# EAGLE schematic rel-alu (EAGLE 9.6.2)
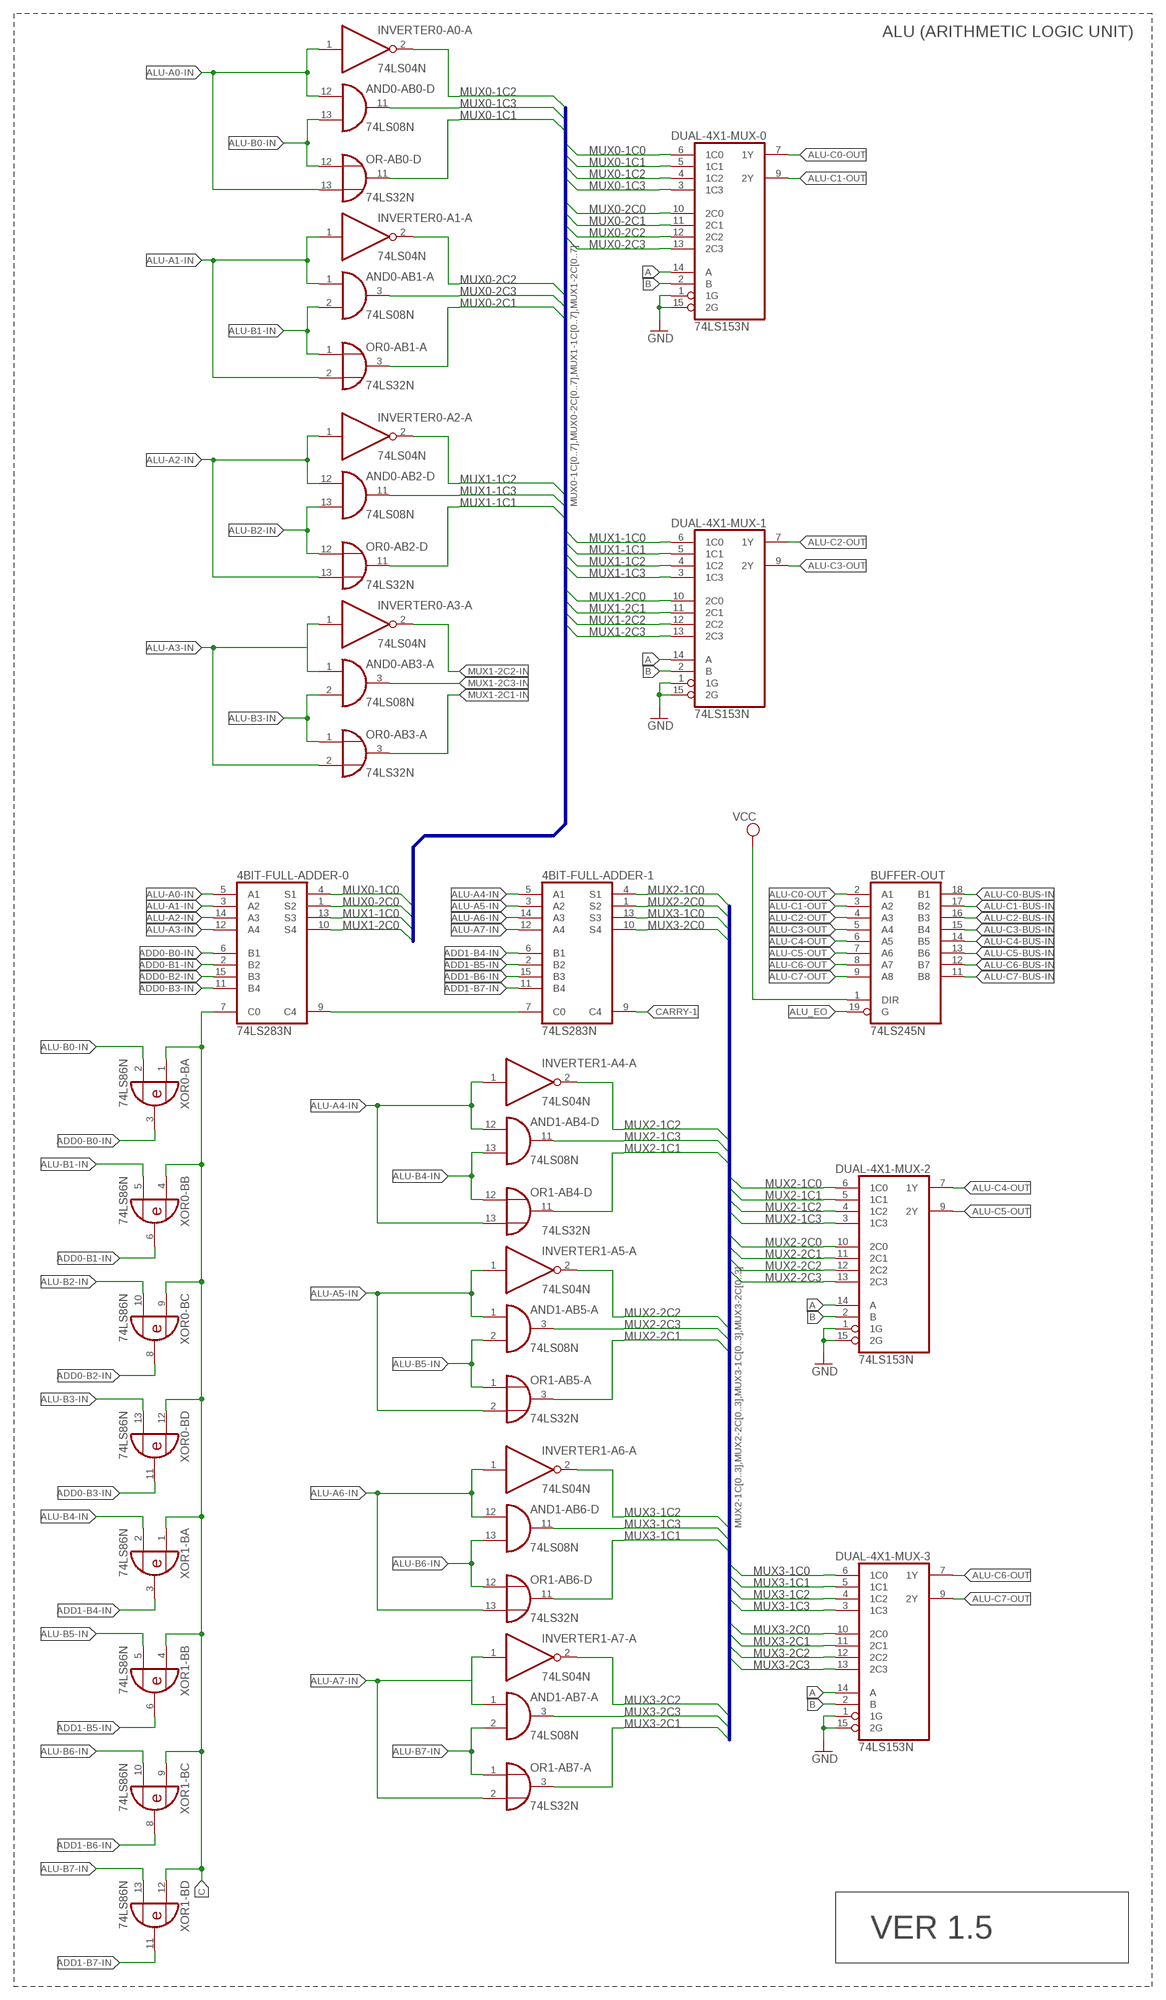
[diagram p0: schematic, sheet 1]

## Parts
4BIT-FULL-ADDER-0  74LS283N  [DIL16]
4BIT-FULL-ADDER-1  74LS283N  [DIL16]
AND0-AB0-  74LS08N  [DIL14]
AND0-AB1-  74LS08N  [DIL14]
AND0-AB2-  74LS08N  [DIL14]
AND0-AB3-  74LS08N  [DIL14]
AND1-AB4-  74LS08N  [DIL14]
AND1-AB5-  74LS08N  [DIL14]
AND1-AB6-  74LS08N  [DIL14]
AND1-AB7-  74LS08N  [DIL14]
BUFFER-OUT  74LS245N  [DIL20]
DUAL-4X1-MUX-0  74LS153N  [DIL16]
DUAL-4X1-MUX-1  74LS153N  [DIL16]
DUAL-4X1-MUX-2  74LS153N  [DIL16]
DUAL-4X1-MUX-3  74LS153N  [DIL16]
INVERTER0-A0-  74LS04N  [DIL14]
INVERTER0-A1-  74LS04N  [DIL14]
INVERTER0-A2-  74LS04N  [DIL14]
INVERTER0-A3-  74LS04N  [DIL14]
INVERTER1-A4-  74LS04N  [DIL14]
INVERTER1-A5-  74LS04N  [DIL14]
INVERTER1-A6-  74LS04N  [DIL14]
INVERTER1-A7-  74LS04N  [DIL14]
OR0-AB1-  74LS32N  [DIL14]
OR0-AB2-  74LS32N  [DIL14]
OR0-AB3-  74LS32N  [DIL14]
OR1-AB4-  74LS32N  [DIL14]
OR1-AB5-  74LS32N  [DIL14]
OR1-AB6-  74LS32N  [DIL14]
OR1-AB7-  74LS32N  [DIL14]
OR-AB0-  74LS32N  [DIL14]
XOR0-B  74LS86N  [DIL14]
XOR1-B  74LS86N  [DIL14]

## Nets
A: DUAL-4X1-MUX-0.14(A) DUAL-4X1-MUX-1.14(A) DUAL-4X1-MUX-2.14(A) DUAL-4X1-MUX-3.14(A)
ADD0-B0-IN: 4BIT-FULL-ADDER-0.6(B1) XOR0-B.3(A:O)
ADD0-B1-IN: 4BIT-FULL-ADDER-0.2(B2) XOR0-B.6(B:O)
ADD0-B2-IN: 4BIT-FULL-ADDER-0.15(B3) XOR0-B.8(C:O)
ADD0-B3-IN: 4BIT-FULL-ADDER-0.11(B4) XOR0-B.11(D:O)
ADD1-B4-IN: 4BIT-FULL-ADDER-1.6(B1) XOR1-B.3(A:O)
ADD1-B5-IN: 4BIT-FULL-ADDER-1.2(B2) XOR1-B.6(B:O)
ADD1-B6-IN: 4BIT-FULL-ADDER-1.15(B3) XOR1-B.8(C:O)
ADD1-B7-IN: 4BIT-FULL-ADDER-1.11(B4) XOR1-B.11(D:O)
ALU-A0-IN: 4BIT-FULL-ADDER-0.5(A1) AND0-AB0-.12(D:I0) INVERTER0-A0-.1(A:I) OR-AB0-.13(D:I1)
ALU-A1-IN: 4BIT-FULL-ADDER-0.3(A2) AND0-AB1-.1(A:I0) INVERTER0-A1-.1(A:I) OR0-AB1-.2(A:I1)
ALU-A2-IN: 4BIT-FULL-ADDER-0.14(A3) AND0-AB2-.12(D:I0) INVERTER0-A2-.1(A:I) OR0-AB2-.13(D:I1)
ALU-A3-IN: 4BIT-FULL-ADDER-0.12(A4) AND0-AB3-.1(A:I0) INVERTER0-A3-.1(A:I) OR0-AB3-.2(A:I1)
ALU-A4-IN: 4BIT-FULL-ADDER-1.5(A1) AND1-AB4-.12(D:I0) INVERTER1-A4-.1(A:I) OR1-AB4-.13(D:I1)
ALU-A5-IN: 4BIT-FULL-ADDER-1.3(A2) AND1-AB5-.1(A:I0) INVERTER1-A5-.1(A:I) OR1-AB5-.2(A:I1)
ALU-A6-IN: 4BIT-FULL-ADDER-1.14(A3) AND1-AB6-.12(D:I0) INVERTER1-A6-.1(A:I) OR1-AB6-.13(D:I1)
ALU-A7-IN: 4BIT-FULL-ADDER-1.12(A4) AND1-AB7-.1(A:I0) INVERTER1-A7-.1(A:I) OR1-AB7-.2(A:I1)
ALU-B0-IN: AND0-AB0-.13(D:I1) OR-AB0-.12(D:I0) XOR0-B.2(A:I1)
ALU-B1-IN: AND0-AB1-.2(A:I1) OR0-AB1-.1(A:I0) XOR0-B.5(B:I1)
ALU-B2-IN: AND0-AB2-.13(D:I1) OR0-AB2-.12(D:I0) XOR0-B.10(C:I1)
ALU-B3-IN: AND0-AB3-.2(A:I1) OR0-AB3-.1(A:I0) XOR0-B.13(D:I1)
ALU-B4-IN: AND1-AB4-.13(D:I1) OR1-AB4-.12(D:I0) XOR1-B.2(A:I1)
ALU-B5-IN: AND1-AB5-.2(A:I1) OR1-AB5-.1(A:I0) XOR1-B.5(B:I1)
ALU-B6-IN: AND1-AB6-.13(D:I1) OR1-AB6-.12(D:I0) XOR1-B.10(C:I1)
ALU-B7-IN: AND1-AB7-.2(A:I1) OR1-AB7-.1(A:I0) XOR1-B.13(D:I1)
ALU-C0-BUS-IN: BUFFER-OUT.18(B1)
ALU-C0-OUT: BUFFER-OUT.2(A1) DUAL-4X1-MUX-0.7(1Y)
ALU-C1-BUS-IN: BUFFER-OUT.17(B2)
ALU-C1-OUT: BUFFER-OUT.3(A2) DUAL-4X1-MUX-0.9(2Y)
ALU-C2-BUS-IN: BUFFER-OUT.16(B3)
ALU-C2-OUT: BUFFER-OUT.4(A3) DUAL-4X1-MUX-1.7(1Y)
ALU-C3-BUS-IN: BUFFER-OUT.15(B4)
ALU-C3-OUT: BUFFER-OUT.5(A4) DUAL-4X1-MUX-1.9(2Y)
ALU-C4-BUS-IN: BUFFER-OUT.14(B5)
ALU-C4-OUT: BUFFER-OUT.6(A5) DUAL-4X1-MUX-2.7(1Y)
ALU-C5-BUS-IN: BUFFER-OUT.13(B6)
ALU-C5-OUT: BUFFER-OUT.7(A6) DUAL-4X1-MUX-2.9(2Y)
ALU-C6-BUS-IN: BUFFER-OUT.12(B7)
ALU-C6-OUT: BUFFER-OUT.8(A7) DUAL-4X1-MUX-3.7(1Y)
ALU-C7-BUS-IN: BUFFER-OUT.11(B8)
ALU-C7-OUT: BUFFER-OUT.9(A8) DUAL-4X1-MUX-3.9(2Y)
ALU_EO: BUFFER-OUT.19(G)
B: DUAL-4X1-MUX-0.2(B) DUAL-4X1-MUX-1.2(B) DUAL-4X1-MUX-2.2(B) DUAL-4X1-MUX-3.2(B)
C: 4BIT-FULL-ADDER-0.7(C0) XOR0-B.1(A:I0) XOR0-B.4(B:I0) XOR0-B.9(C:I0) XOR0-B.12(D:I0) XOR1-B.1(A:I0) XOR1-B.4(B:I0) XOR1-B.9(C:I0) XOR1-B.12(D:I0)
CARRY-1: 4BIT-FULL-ADDER-1.9(C4)
GND: DUAL-4X1-MUX-0.1(1G) DUAL-4X1-MUX-0.15(2G) DUAL-4X1-MUX-1.1(1G) DUAL-4X1-MUX-1.15(2G) DUAL-4X1-MUX-2.1(1G) DUAL-4X1-MUX-2.15(2G) DUAL-4X1-MUX-3.1(1G) DUAL-4X1-MUX-3.15(2G)
MUX0-1C0: 4BIT-FULL-ADDER-0.4(S1) DUAL-4X1-MUX-0.6(1C0)
MUX0-1C1: DUAL-4X1-MUX-0.5(1C1) OR-AB0-.11(D:O)
MUX0-1C2: DUAL-4X1-MUX-0.4(1C2) INVERTER0-A0-.2(A:O)
MUX0-1C3: AND0-AB0-.11(D:O) DUAL-4X1-MUX-0.3(1C3)
MUX0-2C0: 4BIT-FULL-ADDER-0.1(S2) DUAL-4X1-MUX-0.10(2C0)
MUX0-2C1: DUAL-4X1-MUX-0.11(2C1) OR0-AB1-.3(A:O)
MUX0-2C2: DUAL-4X1-MUX-0.12(2C2) INVERTER0-A1-.2(A:O)
MUX0-2C3: AND0-AB1-.3(A:O) DUAL-4X1-MUX-0.13(2C3)
MUX1-1C0: 4BIT-FULL-ADDER-0.13(S3) DUAL-4X1-MUX-1.6(1C0)
MUX1-1C1: DUAL-4X1-MUX-1.5(1C1) OR0-AB2-.11(D:O)
MUX1-1C2: DUAL-4X1-MUX-1.4(1C2) INVERTER0-A2-.2(A:O)
MUX1-1C3: AND0-AB2-.11(D:O) DUAL-4X1-MUX-1.3(1C3)
MUX1-2C0: 4BIT-FULL-ADDER-0.10(S4) DUAL-4X1-MUX-1.10(2C0)
MUX1-2C1: DUAL-4X1-MUX-1.11(2C1)
MUX1-2C1-IN: OR0-AB3-.3(A:O)
MUX1-2C2: DUAL-4X1-MUX-1.12(2C2)
MUX1-2C2-IN: INVERTER0-A3-.2(A:O)
MUX1-2C3: DUAL-4X1-MUX-1.13(2C3)
MUX1-2C3-IN: AND0-AB3-.3(A:O)
MUX2-1C0: 4BIT-FULL-ADDER-1.4(S1) DUAL-4X1-MUX-2.6(1C0)
MUX2-1C1: DUAL-4X1-MUX-2.5(1C1) OR1-AB4-.11(D:O)
MUX2-1C2: DUAL-4X1-MUX-2.4(1C2) INVERTER1-A4-.2(A:O)
MUX2-1C3: AND1-AB4-.11(D:O) DUAL-4X1-MUX-2.3(1C3)
MUX2-2C0: 4BIT-FULL-ADDER-1.1(S2) DUAL-4X1-MUX-2.10(2C0)
MUX2-2C1: DUAL-4X1-MUX-2.11(2C1) OR1-AB5-.3(A:O)
MUX2-2C2: DUAL-4X1-MUX-2.12(2C2) INVERTER1-A5-.2(A:O)
MUX2-2C3: AND1-AB5-.3(A:O) DUAL-4X1-MUX-2.13(2C3)
MUX3-1C0: 4BIT-FULL-ADDER-1.13(S3) DUAL-4X1-MUX-3.6(1C0)
MUX3-1C1: DUAL-4X1-MUX-3.5(1C1) OR1-AB6-.11(D:O)
MUX3-1C2: DUAL-4X1-MUX-3.4(1C2) INVERTER1-A6-.2(A:O)
MUX3-1C3: AND1-AB6-.11(D:O) DUAL-4X1-MUX-3.3(1C3)
MUX3-2C0: 4BIT-FULL-ADDER-1.10(S4) DUAL-4X1-MUX-3.10(2C0)
MUX3-2C1: DUAL-4X1-MUX-3.11(2C1) OR1-AB7-.3(A:O)
MUX3-2C2: DUAL-4X1-MUX-3.12(2C2) INVERTER1-A7-.2(A:O)
MUX3-2C3: AND1-AB7-.3(A:O) DUAL-4X1-MUX-3.13(2C3)
N$1: 4BIT-FULL-ADDER-0.9(C4) 4BIT-FULL-ADDER-1.7(C0)
VCC: BUFFER-OUT.1(DIR)
Unconnected: AND0-AB0-.1(A:I0) AND0-AB0-.2(A:I1) AND0-AB0-.3(A:O) AND0-AB0-.4(B:I0) AND0-AB0-.5(B:I1) AND0-AB0-.6(B:O) AND0-AB0-.8(C:O) AND0-AB0-.9(C:I0) AND0-AB0-.10(C:I1) AND0-AB1-.4(B:I0) AND0-AB1-.5(B:I1) AND0-AB1-.6(B:O) AND0-AB1-.8(C:O) AND0-AB1-.9(C:I0) AND0-AB1-.10(C:I1) AND0-AB1-.11(D:O) AND0-AB1-.12(D:I0) AND0-AB1-.13(D:I1) AND0-AB2-.1(A:I0) AND0-AB2-.2(A:I1) AND0-AB2-.3(A:O) AND0-AB2-.4(B:I0) AND0-AB2-.5(B:I1) AND0-AB2-.6(B:O) AND0-AB2-.8(C:O) AND0-AB2-.9(C:I0) AND0-AB2-.10(C:I1) AND0-AB3-.4(B:I0) AND0-AB3-.5(B:I1) AND0-AB3-.6(B:O) AND0-AB3-.8(C:O) AND0-AB3-.9(C:I0) AND0-AB3-.10(C:I1) AND0-AB3-.11(D:O) AND0-AB3-.12(D:I0) AND0-AB3-.13(D:I1) AND1-AB4-.1(A:I0) AND1-AB4-.2(A:I1) AND1-AB4-.3(A:O) AND1-AB4-.4(B:I0) AND1-AB4-.5(B:I1) AND1-AB4-.6(B:O) AND1-AB4-.8(C:O) AND1-AB4-.9(C:I0) AND1-AB4-.10(C:I1) AND1-AB5-.4(B:I0) AND1-AB5-.5(B:I1) AND1-AB5-.6(B:O) AND1-AB5-.8(C:O) AND1-AB5-.9(C:I0) AND1-AB5-.10(C:I1) AND1-AB5-.11(D:O) AND1-AB5-.12(D:I0) AND1-AB5-.13(D:I1) AND1-AB6-.1(A:I0) AND1-AB6-.2(A:I1) AND1-AB6-.3(A:O) AND1-AB6-.4(B:I0) AND1-AB6-.5(B:I1) AND1-AB6-.6(B:O) AND1-AB6-.8(C:O) AND1-AB6-.9(C:I0) AND1-AB6-.10(C:I1) AND1-AB7-.4(B:I0) AND1-AB7-.5(B:I1) AND1-AB7-.6(B:O) AND1-AB7-.8(C:O) AND1-AB7-.9(C:I0) AND1-AB7-.10(C:I1) AND1-AB7-.11(D:O) AND1-AB7-.12(D:I0) AND1-AB7-.13(D:I1) INVERTER0-A0-.3(B:I) INVERTER0-A0-.4(B:O) INVERTER0-A0-.5(C:I) INVERTER0-A0-.6(C:O) INVERTER0-A0-.8(D:O) INVERTER0-A0-.9(D:I) INVERTER0-A0-.10(E:O) INVERTER0-A0-.11(E:I) INVERTER0-A0-.12(F:O) INVERTER0-A0-.13(F:I) INVERTER0-A1-.3(B:I) INVERTER0-A1-.4(B:O) INVERTER0-A1-.5(C:I) INVERTER0-A1-.6(C:O) INVERTER0-A1-.8(D:O) INVERTER0-A1-.9(D:I) INVERTER0-A1-.10(E:O) INVERTER0-A1-.11(E:I) INVERTER0-A1-.12(F:O) INVERTER0-A1-.13(F:I) INVERTER0-A2-.3(B:I) INVERTER0-A2-.4(B:O) INVERTER0-A2-.5(C:I) INVERTER0-A2-.6(C:O) INVERTER0-A2-.8(D:O) INVERTER0-A2-.9(D:I) INVERTER0-A2-.10(E:O) INVERTER0-A2-.11(E:I) INVERTER0-A2-.12(F:O) INVERTER0-A2-.13(F:I) INVERTER0-A3-.3(B:I) INVERTER0-A3-.4(B:O) INVERTER0-A3-.5(C:I) INVERTER0-A3-.6(C:O) INVERTER0-A3-.8(D:O) INVERTER0-A3-.9(D:I) INVERTER0-A3-.10(E:O) INVERTER0-A3-.11(E:I) INVERTER0-A3-.12(F:O) INVERTER0-A3-.13(F:I) INVERTER1-A4-.3(B:I) INVERTER1-A4-.4(B:O) INVERTER1-A4-.5(C:I) INVERTER1-A4-.6(C:O) INVERTER1-A4-.8(D:O) INVERTER1-A4-.9(D:I) INVERTER1-A4-.10(E:O) INVERTER1-A4-.11(E:I) INVERTER1-A4-.12(F:O) INVERTER1-A4-.13(F:I) INVERTER1-A5-.3(B:I) INVERTER1-A5-.4(B:O) INVERTER1-A5-.5(C:I) INVERTER1-A5-.6(C:O) INVERTER1-A5-.8(D:O) INVERTER1-A5-.9(D:I) INVERTER1-A5-.10(E:O) INVERTER1-A5-.11(E:I) INVERTER1-A5-.12(F:O) INVERTER1-A5-.13(F:I) INVERTER1-A6-.3(B:I) INVERTER1-A6-.4(B:O) INVERTER1-A6-.5(C:I) INVERTER1-A6-.6(C:O) INVERTER1-A6-.8(D:O) INVERTER1-A6-.9(D:I) INVERTER1-A6-.10(E:O) INVERTER1-A6-.11(E:I) INVERTER1-A6-.12(F:O) INVERTER1-A6-.13(F:I) INVERTER1-A7-.3(B:I) INVERTER1-A7-.4(B:O) INVERTER1-A7-.5(C:I) INVERTER1-A7-.6(C:O) INVERTER1-A7-.8(D:O) INVERTER1-A7-.9(D:I) INVERTER1-A7-.10(E:O) INVERTER1-A7-.11(E:I) INVERTER1-A7-.12(F:O) INVERTER1-A7-.13(F:I) OR0-AB1-.4(B:I0) OR0-AB1-.5(B:I1) OR0-AB1-.6(B:O) OR0-AB1-.8(C:O) OR0-AB1-.9(C:I0) OR0-AB1-.10(C:I1) OR0-AB1-.11(D:O) OR0-AB1-.12(D:I0) OR0-AB1-.13(D:I1) OR0-AB2-.1(A:I0) OR0-AB2-.2(A:I1) OR0-AB2-.3(A:O) OR0-AB2-.4(B:I0) OR0-AB2-.5(B:I1) OR0-AB2-.6(B:O) OR0-AB2-.8(C:O) OR0-AB2-.9(C:I0) OR0-AB2-.10(C:I1) OR0-AB3-.4(B:I0) OR0-AB3-.5(B:I1) OR0-AB3-.6(B:O) OR0-AB3-.8(C:O) OR0-AB3-.9(C:I0) OR0-AB3-.10(C:I1) OR0-AB3-.11(D:O) OR0-AB3-.12(D:I0) OR0-AB3-.13(D:I1) OR1-AB4-.1(A:I0) OR1-AB4-.2(A:I1) OR1-AB4-.3(A:O) OR1-AB4-.4(B:I0) OR1-AB4-.5(B:I1) OR1-AB4-.6(B:O) OR1-AB4-.8(C:O) OR1-AB4-.9(C:I0) OR1-AB4-.10(C:I1) OR1-AB5-.4(B:I0) OR1-AB5-.5(B:I1) OR1-AB5-.6(B:O) OR1-AB5-.8(C:O) OR1-AB5-.9(C:I0) OR1-AB5-.10(C:I1) OR1-AB5-.11(D:O) OR1-AB5-.12(D:I0) OR1-AB5-.13(D:I1) OR1-AB6-.1(A:I0) OR1-AB6-.2(A:I1) OR1-AB6-.3(A:O) OR1-AB6-.4(B:I0) OR1-AB6-.5(B:I1) OR1-AB6-.6(B:O) OR1-AB6-.8(C:O) OR1-AB6-.9(C:I0) OR1-AB6-.10(C:I1) OR1-AB7-.4(B:I0) OR1-AB7-.5(B:I1) OR1-AB7-.6(B:O) OR1-AB7-.8(C:O) OR1-AB7-.9(C:I0) OR1-AB7-.10(C:I1) OR1-AB7-.11(D:O) OR1-AB7-.12(D:I0) OR1-AB7-.13(D:I1) OR-AB0-.1(A:I0) OR-AB0-.2(A:I1) OR-AB0-.3(A:O) OR-AB0-.4(B:I0) OR-AB0-.5(B:I1) OR-AB0-.6(B:O) OR-AB0-.8(C:O) OR-AB0-.9(C:I0) OR-AB0-.10(C:I1)

## Buses
MUX0-1C[0..7],MUX0-2C[0..7],MUX1-1C[0..7],MUX1-2C[0..7]
MUX2-1C[0..3],MUX2-2C[0..3],MUX3-1C[0..3],MUX3-2C[0..3]

## Notes on the sheet
- ALU (ARITHMETIC LOGIC UNIT)
- VER 1.5

## Power pins joined to a net without a drawn wire
GND: 4BIT-FULL-ADDER-0.8(GND) 4BIT-FULL-ADDER-1.8(GND) AND0-AB0-.7(P:GND) AND0-AB1-.7(P:GND) AND0-AB2-.7(P:GND) AND0-AB3-.7(P:GND) AND1-AB4-.7(P:GND) AND1-AB5-.7(P:GND) AND1-AB6-.7(P:GND) AND1-AB7-.7(P:GND) BUFFER-OUT.10(GND) DUAL-4X1-MUX-0.8(GND) DUAL-4X1-MUX-1.8(GND) DUAL-4X1-MUX-2.8(GND) DUAL-4X1-MUX-3.8(GND) INVERTER0-A0-.7(P:GND) INVERTER0-A1-.7(P:GND) INVERTER0-A2-.7(P:GND) INVERTER0-A3-.7(P:GND) INVERTER1-A4-.7(P:GND) INVERTER1-A5-.7(P:GND) INVERTER1-A6-.7(P:GND) INVERTER1-A7-.7(P:GND) OR0-AB1-.7(P:GND) OR0-AB2-.7(P:GND) OR0-AB3-.7(P:GND) OR1-AB4-.7(P:GND) OR1-AB5-.7(P:GND) OR1-AB6-.7(P:GND) OR1-AB7-.7(P:GND) OR-AB0-.7(P:GND) XOR0-B.7(P:GND) XOR1-B.7(P:GND)
VCC: 4BIT-FULL-ADDER-0.16(VCC) 4BIT-FULL-ADDER-1.16(VCC) AND0-AB0-.14(P:VCC) AND0-AB1-.14(P:VCC) AND0-AB2-.14(P:VCC) AND0-AB3-.14(P:VCC) AND1-AB4-.14(P:VCC) AND1-AB5-.14(P:VCC) AND1-AB6-.14(P:VCC) AND1-AB7-.14(P:VCC) BUFFER-OUT.20(VCC) DUAL-4X1-MUX-0.16(VCC) DUAL-4X1-MUX-1.16(VCC) DUAL-4X1-MUX-2.16(VCC) DUAL-4X1-MUX-3.16(VCC) INVERTER0-A0-.14(P:VCC) INVERTER0-A1-.14(P:VCC) INVERTER0-A2-.14(P:VCC) INVERTER0-A3-.14(P:VCC) INVERTER1-A4-.14(P:VCC) INVERTER1-A5-.14(P:VCC) INVERTER1-A6-.14(P:VCC) INVERTER1-A7-.14(P:VCC) OR0-AB1-.14(P:VCC) OR0-AB2-.14(P:VCC) OR0-AB3-.14(P:VCC) OR1-AB4-.14(P:VCC) OR1-AB5-.14(P:VCC) OR1-AB6-.14(P:VCC) OR1-AB7-.14(P:VCC) OR-AB0-.14(P:VCC) XOR0-B.14(P:VCC) XOR1-B.14(P:VCC)

## Library data of the parts
4BIT-FULL-ADDER-0 4BIT-FULL-ADDER-1 = 74xx-eu:74*283: 4-bit binary FULL ADDER, fast carry
AND0-AB0- AND0-AB1- AND0-AB2- AND0-AB3- AND1-AB4- AND1-AB5- AND1-AB6- AND1-AB7- = 74xx-eu:74*08: Quad 2-input AND gate
BUFFER-OUT = 74xx-eu:74*245: Octal BUS TRANSCEIVER, 3-state
DUAL-4X1-MUX-0 DUAL-4X1-MUX-1-DUAL-4X1-MUX-3 = 74xx-eu:74*153: Dual 4-line to 1-line data SELECTOR/MULTIPLEXER
INVERTER0-A0- INVERTER0-A1- INVERTER0-A2- INVERTER0-A3- INVERTER1-A4- INVERTER1-A5- INVERTER1-A6- INVERTER1-A7- = 74xx-eu:74*04: Hex INVERTER
OR0-AB1- OR0-AB2- OR0-AB3- OR1-AB4- OR1-AB5- OR1-AB6- OR1-AB7- OR-AB0- = 74xx-eu:74*32: Quad 2-input OR gate
XOR0-B XOR1-B = 74xx-eu:74*86: Quad 2-input EXCLUSIVE-OR (XOR) gate